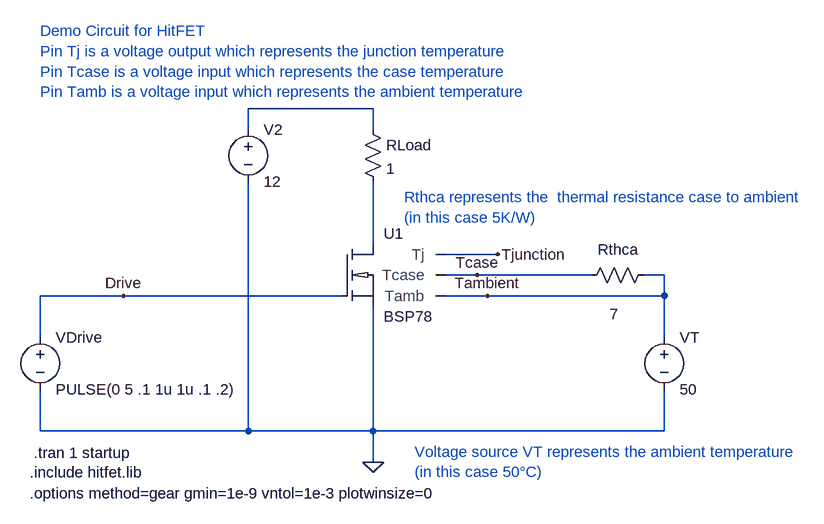
[diagram p0: schematic HitFET_Demo.asc]
HitFET_Demo.asc, the LTspice schematic file:
Version 4
SHEET 1 1044 680
WIRE 240 -144 48 -144
WIRE 48 -112 48 -144
WIRE 240 -112 240 -144
WIRE 240 64 240 -32
WIRE 432 80 352 80
WIRE 400 112 352 112
WIRE 576 112 400 112
WIRE 688 112 656 112
WIRE -144 144 -272 144
WIRE 192 144 -144 144
WIRE 416 144 352 144
WIRE 688 144 688 112
WIRE 688 144 416 144
WIRE -272 208 -272 144
WIRE 688 208 688 144
WIRE -272 352 -272 288
WIRE 48 352 48 -32
WIRE 48 352 -272 352
WIRE 240 352 240 160
WIRE 240 352 48 352
WIRE 688 352 688 288
WIRE 688 352 240 352
WIRE 240 400 240 352
FLAG 240 400 0
FLAG 432 80 Tjunction
FLAG 400 112 Tcase
FLAG 416 144 Tambient
FLAG -144 144 Drive
SYMBOL voltage -272 192 R0
WINDOW 123 0 0 Left 0
WINDOW 39 0 0 Left 0
SYMATTR InstName VDrive
SYMATTR Value PULSE(0 5 .1 1u 1u .1 .2)
SYMBOL hitfet 192 64 R0
SYMATTR InstName U1
SYMATTR SpiceModel BSP78
SYMBOL res 224 -128 R0
SYMATTR InstName RLoad
SYMATTR Value 1
SYMBOL voltage 688 192 R0
WINDOW 123 0 0 Left 0
WINDOW 39 0 0 Left 0
SYMATTR InstName VT
SYMATTR Value 50
SYMBOL voltage 48 -128 R0
WINDOW 123 0 0 Left 0
WINDOW 39 0 0 Left 0
SYMATTR InstName V2
SYMATTR Value 12
SYMBOL res 672 96 R90
WINDOW 0 -8 55 VBottom 0
WINDOW 3 60 61 VTop 0
SYMATTR InstName Rthca
SYMATTR Value 7
TEXT -282 386 Left 0 !.tran 1 startup
TEXT -288 416 Left 0 !.include hitfet.lib
TEXT -272 -264 Left 0 ;Demo Circuit for HitFET\nPin Tj is a voltage output which represents the junction temperature\nPin Tcase is a voltage input which represents the case temperature\nPin Tamb is a voltage input which represents the ambient temperature
TEXT 288 -8 Left 0 ;Rthca represents the  thermal resistance case to ambient\n(in this case 5K/W)
TEXT 304 384 Left 0 ;Voltage source VT represents the ambient temperature\n(in this case 50°C)
TEXT -288 448 Left 0 !.options method=gear gmin=1e-9 vntol=1e-3 plotwinsize=0

The netlist it stands for:
* HitFET_Demo.asc
VDrive Drive 0 PULSE(0 5 .1 1u 1u .1 .2)
XU1 Drive N002 0 Tjunction Tcase Tambient BSP78  ; pins G D S Tj TCase amb
RLoad N001 N002 1
VT Tambient 0 50
V2 N001 0 12
Rthca Tambient Tcase 7
.tran 1 startup
.include hitfet.lib
* Demo Circuit for HitFET
* Pin Tj is a voltage output which represents the junction temperature
* Pin Tcase is a voltage input which represents the case temperature
* Pin Tamb is a voltage input which represents the ambient temperature
* Rthca represents the  thermal resistance case to ambient
* (in this case 5K/W)
* Voltage source VT represents the ambient temperature
* (in this case 50°C)
.options method=gear gmin=1e-9 vntol=1e-3 plotwinsize=0
.backanno
.end